# EAGLE design QUADBED (EAGLE 9.4.2)
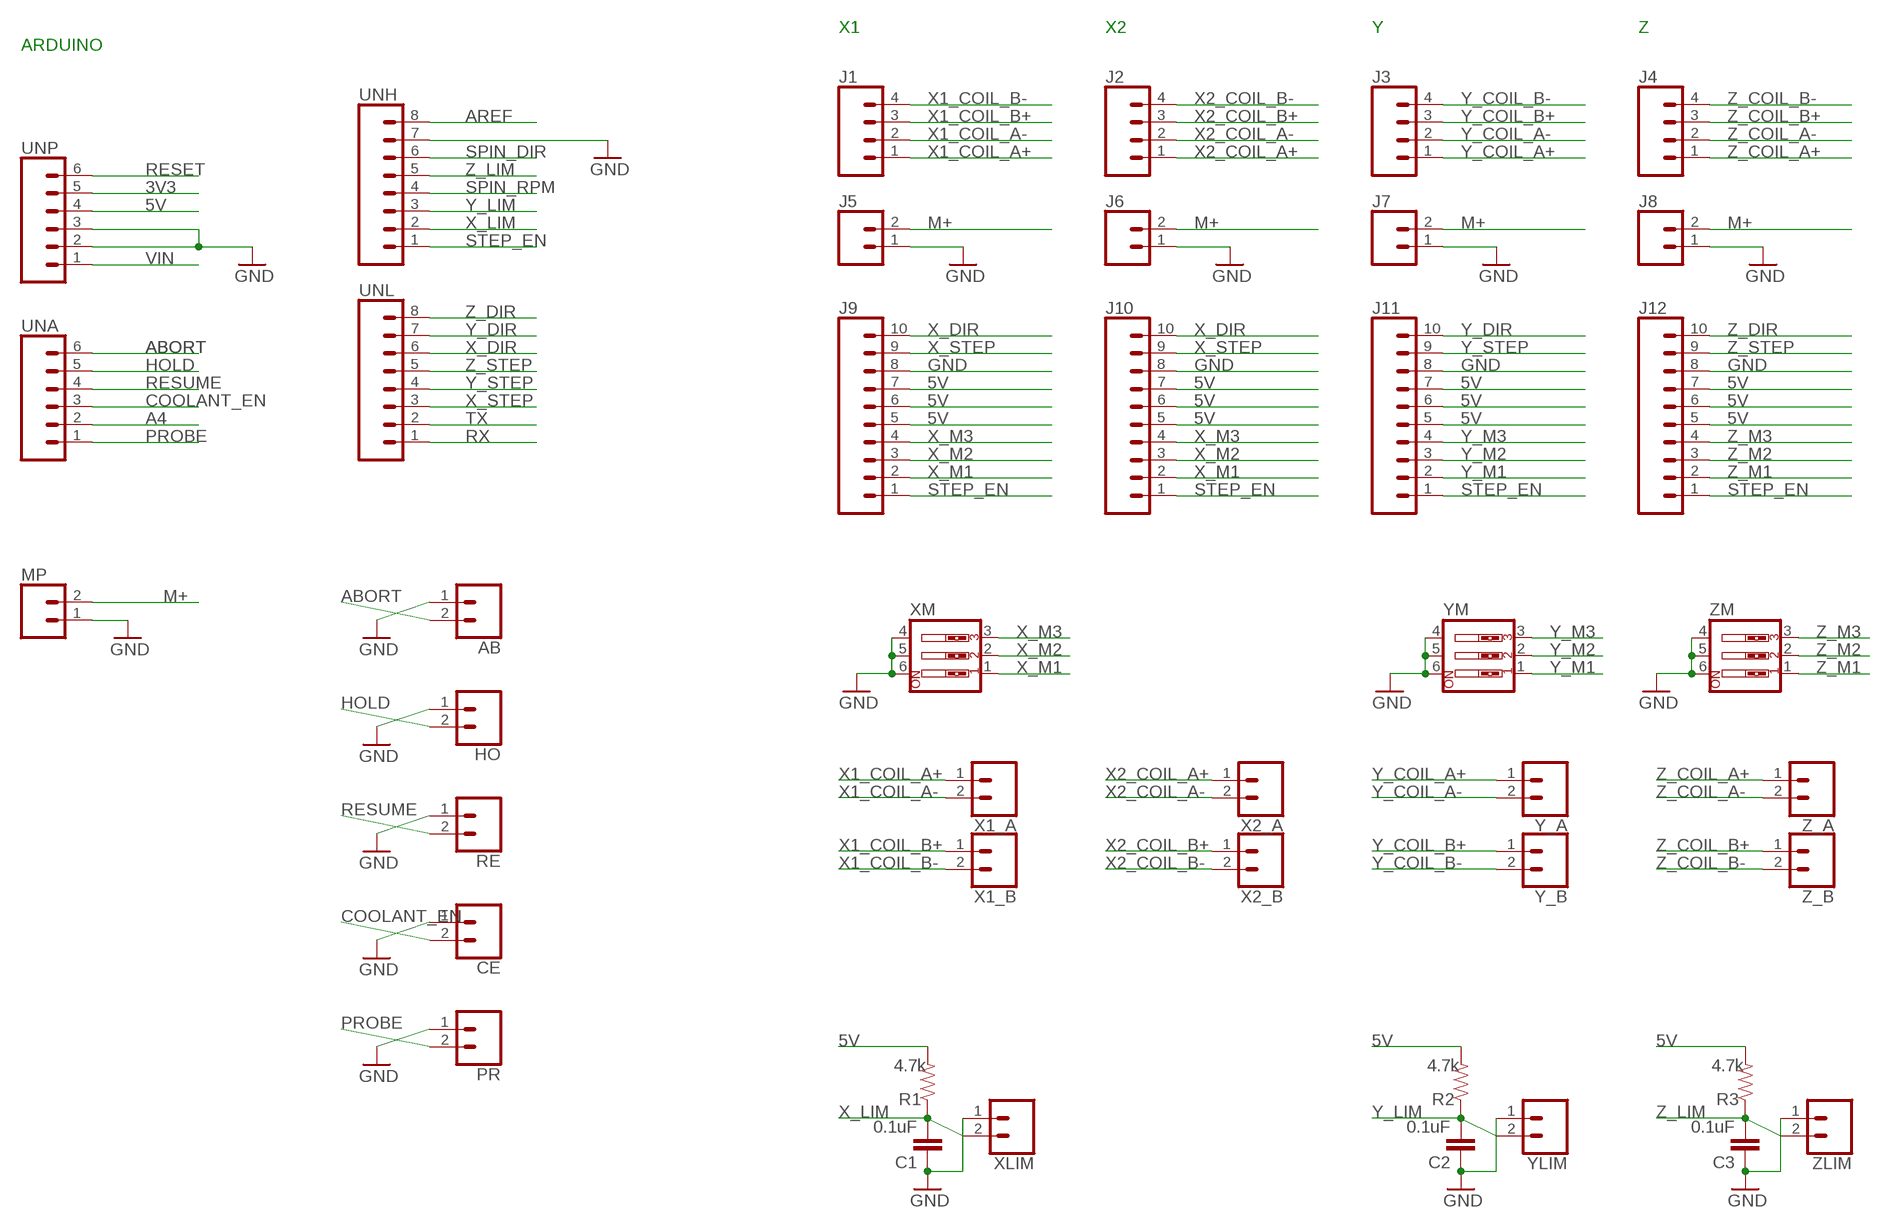
[diagram p0: schematic, sheet 1]

## Parts
AB  CONN_023.5MM  [SCREWTERMINAL-3.5MM-2]
C1  0.1uF  0.1UF-0603-100V-10%  [0603]
C2  0.1uF  0.1UF-0603-100V-10%  [0603]
C3  0.1uF  0.1UF-0603-100V-10%  [0603]
CE  CONN_023.5MM  [SCREWTERMINAL-3.5MM-2]
HO  CONN_023.5MM  [SCREWTERMINAL-3.5MM-2]
J1  CONN_04  [1X04]
J2  CONN_04  [1X04]
J3  CONN_04  [1X04]
J4  CONN_04  [1X04]
J5  CONN_02  [1X02]
J6  CONN_02  [1X02]
J7  CONN_02  [1X02]
J8  CONN_02  [1X02]
J9  CONN_10"  [1X10]
J10  CONN_10"  [1X10]
J11  CONN_10"  [1X10]
J12  CONN_10"  [1X10]
MP  CONN_023.5MM  [SCREWTERMINAL-3.5MM-2]
PR  CONN_023.5MM  [SCREWTERMINAL-3.5MM-2]
R1  4.7k  4.7KOHM-0603-1/10W-1%  [0603]
R2  4.7k  4.7KOHM-0603-1/10W-1%  [0603]
R3  4.7k  4.7KOHM-0603-1/10W-1%  [0603]
RE  CONN_023.5MM  [SCREWTERMINAL-3.5MM-2]
UNA  CONN_06SILK_FEMALE_PTH  [1X06]
UNH  CONN_08"  [1X08]
UNL  CONN_08"  [1X08]
UNP  CONN_06SILK_FEMALE_PTH  [1X06]
X1_A  CONN_023.5MM  [SCREWTERMINAL-3.5MM-2]
X1_B  CONN_023.5MM  [SCREWTERMINAL-3.5MM-2]
X2_A  CONN_023.5MM  [SCREWTERMINAL-3.5MM-2]
X2_B  CONN_023.5MM  [SCREWTERMINAL-3.5MM-2]
XLIM  CONN_023.5MM  [SCREWTERMINAL-3.5MM-2]
XM  SW_DIP-3  [EDG-03]
Y_A  CONN_023.5MM  [SCREWTERMINAL-3.5MM-2]
Y_B  CONN_023.5MM  [SCREWTERMINAL-3.5MM-2]
YLIM  CONN_023.5MM  [SCREWTERMINAL-3.5MM-2]
YM  SW_DIP-3  [EDG-03]
Z_A  CONN_023.5MM  [SCREWTERMINAL-3.5MM-2]
Z_B  CONN_023.5MM  [SCREWTERMINAL-3.5MM-2]
ZLIM  CONN_023.5MM  [SCREWTERMINAL-3.5MM-2]
ZM  SW_DIP-3  [EDG-03]

## Nets
3V3: UNP.5
5V: J9.5 J9.6 J9.7 J10.5 J10.6 J10.7 J11.5 J11.6 J11.7 J12.5 J12.6 J12.7 R1.2 R2.2 R3.2 UNP.4
A4: UNA.2
ABORT: AB.2 UNA.6
AREF: UNH.8
COOLANT_EN: CE.2 UNA.3
GND: AB.1 C1.1 C2.1 C3.1 CE.1 HO.1 J5.1 J6.1 J7.1 J8.1 J9.8 J10.8 J11.8 J12.8 MP.1 PR.1 RE.1 UNH.7 UNP.2 UNP.3 XLIM.1 XM.4 XM.5 XM.6 YLIM.1 YM.4 YM.5 YM.6 ZLIM.1 ZM.4 ZM.5 ZM.6
HOLD: HO.2 UNA.5
M+: J5.2 J6.2 J7.2 J8.2 MP.2
PROBE: PR.2 UNA.1
RESET: UNP.6
RESUME: RE.2 UNA.4
RX: UNL.1
SPIN_DIR: UNH.6
SPIN_RPM: UNH.4
STEP_EN: J9.1 J10.1 J11.1 J12.1 UNH.1
TX: UNL.2
VIN: UNP.1
X1_COIL_A+: J1.1 X1_A.1
X1_COIL_A-: J1.2 X1_A.2
X1_COIL_B+: J1.3 X1_B.1
X1_COIL_B-: J1.4 X1_B.2
X2_COIL_A+: J2.1 X2_A.1
X2_COIL_A-: J2.2 X2_A.2
X2_COIL_B+: J2.3 X2_B.1
X2_COIL_B-: J2.4 X2_B.2
X_DIR: J9.10 J10.10 UNL.6
X_LIM: C1.2 R1.1 UNH.2 XLIM.2
X_M1: J9.2 J10.2 XM.1
X_M2: J9.3 J10.3 XM.2
X_M3: J9.4 J10.4 XM.3
X_STEP: J9.9 J10.9 UNL.3
Y_COIL_A+: J3.1 Y_A.1
Y_COIL_A-: J3.2 Y_A.2
Y_COIL_B+: J3.3 Y_B.1
Y_COIL_B-: J3.4 Y_B.2
Y_DIR: J11.10 UNL.7
Y_LIM: C2.2 R2.1 UNH.3 YLIM.2
Y_M1: J11.2 YM.1
Y_M2: J11.3 YM.2
Y_M3: J11.4 YM.3
Y_STEP: J11.9 UNL.4
Z_COIL_A+: J4.1 Z_A.1
Z_COIL_A-: J4.2 Z_A.2
Z_COIL_B+: J4.3 Z_B.1
Z_COIL_B-: J4.4 Z_B.2
Z_DIR: J12.10 UNL.8
Z_LIM: C3.2 R3.1 UNH.5 ZLIM.2
Z_M1: J12.2 ZM.1
Z_M2: J12.3 ZM.2
Z_M3: J12.4 ZM.3
Z_STEP: J12.9 UNL.5

## Notes on the sheet
- X1 | X2 | Y | Z
- ARDUINO

## Library data of the parts
AB CE HO PR RE X1_A X1_B X2_A X2_B XLIM Y_A Y_B YLIM Z_A Z_B ZLIM = SparkFun-Connectors:CONN_02: Multi connection point. Often used as Generic Header-pin footprint for 0.1 inch spaced/style header connections On any of the 0.1 inch spaced packages, you can populate with these: Break Away Headers - Straight <https://www.sparkfun.com/products/116> (PRT-00116) Break Away Male Headers - Right Angle <https://www.sparkfun.com/products/553> (PRT-00553) Female Headers <https://www.sparkfun.com/products/115> (PRT-00115) Break Away Headers - Machine Pin <https://www.sparkfun.com/products/117> (PRT-00117) Break Away Female Headers - Swiss Machine Pin <https://www.sparkfun.com/products/743> (PRT-00743) For SCREWTERMINALS and SPRING TERMINALS visit here: Screw Terimnals on SparkFun.com <https://www.sparkfun.com/search/results?term=Screw+Terminals> (5mm/3.5mm/2.54mm spacing) This device is also useful as a general connection point to wire up your design to another part of your project. Our various solder wires solder well into these plated through hole pads. Hook-Up Wire - Assortment (Stranded, 22 AWG) <https://www.sparkfun.com/products/11375> (PRT-11375) Hook-Up Wire - Assortment (Solid Core, 22 AWG) <https://www.sparkfun.com/products/11367> (PRT-11367) View the entire wire category on our website here <https://www.sparkfun.com/categories/141> Special notes: Molex polarized connector foot print use with: PRT-08233 with associated crimp pins and housings. 2.54_SCREWTERM for use with PRT-10571. 3.5mm Screw Terminal footprints for PRT-08084 5mm Screw Terminal footprints for use with PRT-08432; PROD_ID: CONN-08399
C1-C3 = SparkFun-Capacitors:0.1UF: 0.1µF ceramic capacitors A capacitor is a passive two-terminal electrical component used to store electrical energy temporarily in an electric field.; PROD_ID: CAP-08390
J1-J4 = SparkFun-Connectors:CONN_04: Multi connection point. Often used as Generic Header-pin footprint for 0.1 inch spaced/style header connections On any of the 0.1 inch spaced packages, you can populate with these: Break Away Headers - Straight <https://www.sparkfun.com/products/116> (PRT-00116) Break Away Male Headers - Right Angle <https://www.sparkfun.com/products/553> (PRT-00553) Female Headers <https://www.sparkfun.com/products/115> (PRT-00115) Break Away Headers - Machine Pin <https://www.sparkfun.com/products/117> (PRT-00117) Break Away Female Headers - Swiss Machine Pin <https://www.sparkfun.com/products/743> (PRT-00743) For SCREWTERMINALS and SPRING TERMINALS visit here: Screw Terimnals on SparkFun.com <https://www.sparkfun.com/search/results?term=Screw+Terminals> (5mm/3.5mm/2.54mm spacing) This device is also useful as a general connection point to wire up your design to another part of your project. Our various solder wires solder well into these plated through hole pads. Hook-Up Wire - Assortment (Stranded, 22 AWG) <https://www.sparkfun.com/products/11375> (PRT-11375) Hook-Up Wire - Assortment (Solid Core, 22 AWG) <https://www.sparkfun.com/products/11367> (PRT-11367) View the entire wire category on our website here <https://www.sparkfun.com/categories/141> Special notes: Molex polarized connector foot print use with SKU : PRT-08231 with associated crimp pins and housings. 1MM SMD Version SKU: PRT-10208; PROD_ID: CONN-09696
J5-J8 = SparkFun-Connectors:CONN_02: Multi connection point. Often used as Generic Header-pin footprint for 0.1 inch spaced/style header connections On any of the 0.1 inch spaced packages, you can populate with these: Break Away Headers - Straight <https://www.sparkfun.com/products/116> (PRT-00116) Break Away Male Headers - Right Angle <https://www.sparkfun.com/products/553> (PRT-00553) Female Headers <https://www.sparkfun.com/products/115> (PRT-00115) Break Away Headers - Machine Pin <https://www.sparkfun.com/products/117> (PRT-00117) Break Away Female Headers - Swiss Machine Pin <https://www.sparkfun.com/products/743> (PRT-00743) For SCREWTERMINALS and SPRING TERMINALS visit here: Screw Terimnals on SparkFun.com <https://www.sparkfun.com/search/results?term=Screw+Terminals> (5mm/3.5mm/2.54mm spacing) This device is also useful as a general connection point to wire up your design to another part of your project. Our various solder wires solder well into these plated through hole pads. Hook-Up Wire - Assortment (Stranded, 22 AWG) <https://www.sparkfun.com/products/11375> (PRT-11375) Hook-Up Wire - Assortment (Solid Core, 22 AWG) <https://www.sparkfun.com/products/11367> (PRT-11367) View the entire wire category on our website here <https://www.sparkfun.com/categories/141> Special notes: Molex polarized connector foot print use with: PRT-08233 with associated crimp pins and housings. 2.54_SCREWTERM for use with PRT-10571. 3.5mm Screw Terminal footprints for PRT-08084 5mm Screw Terminal footprints for use with PRT-08432
J9-J12 = SparkFun-Connectors:CONN_10: Multi connection point. Often used as Generic Header-pin footprint for 0.1 inch spaced/style header connections On any of the 0.1 inch spaced packages, you can populate with these: Break Away Headers - Straight <https://www.sparkfun.com/products/116> (PRT-00116) Break Away Male Headers - Right Angle <https://www.sparkfun.com/products/553> (PRT-00553) Female Headers <https://www.sparkfun.com/products/115> (PRT-00115) Break Away Headers - Machine Pin <https://www.sparkfun.com/products/117> (PRT-00117) Break Away Female Headers - Swiss Machine Pin <https://www.sparkfun.com/products/743> (PRT-00743) Arduino Stackable Header - 10 Pin <https://www.sparkfun.com/products/11376> (PRT-11376) For SCREWTERMINALS and SPRING TERMINALS visit here: Screw Terimnals on SparkFun.com <https://www.sparkfun.com/search/results?term=Screw+Terminals> (5mm/3.5mm/2.54mm spacing) This device is also useful as a general connection point to wire up your design to another part of your project. Our various solder wires solder well into these plated through hole pads. Hook-Up Wire - Assortment (Stranded, 22 AWG) <https://www.sparkfun.com/products/11375> (PRT-11375) Hook-Up Wire - Assortment (Solid Core, 22 AWG) <https://www.sparkfun.com/products/11367> (PRT-11367) View the entire wire category on our website here <https://www.sparkfun.com/categories/141> Special notes: Molex polarized connector foot print use with SKU : PRT-08231 with associated crimp pins and housings. 1MM SMD Version SKU: PRT-10208 NOTES ON THE VARIANTS LOCK and LOCK_LONGPADS... This footprint was designed to help hold the alignment of a through-hole component (i.e. 6-pin header) while soldering it into place. You may notice that each hole has been shifted either up or down by 0.005 of an inch from it's more standard position (which is a perfectly straight line). This slight alteration caused the pins (the squares in the middle) to touch the edges of the holes. Because they are alternating, it causes a "brace" to hold the component in place. 0.005 has proven to be the perfect amount of "off-center" position when using our standard breakaway headers. Although looks a little odd when you look at the bare footprint, once you have a header in there, the alteration is very hard to notice. Also,if you push a header all the way into place, it is covered up entirely on the bottom side.; PROD_ID: CONN-11563
MP = SparkFun-Connectors:CONN_02: Multi connection point. Often used as Generic Header-pin footprint for 0.1 inch spaced/style header connections On any of the 0.1 inch spaced packages, you can populate with these: Break Away Headers - Straight <https://www.sparkfun.com/products/116> (PRT-00116) Break Away Male Headers - Right Angle <https://www.sparkfun.com/products/553> (PRT-00553) Female Headers <https://www.sparkfun.com/products/115> (PRT-00115) Break Away Headers - Machine Pin <https://www.sparkfun.com/products/117> (PRT-00117) Break Away Female Headers - Swiss Machine Pin <https://www.sparkfun.com/products/743> (PRT-00743) For SCREWTERMINALS and SPRING TERMINALS visit here: Screw Terimnals on SparkFun.com <https://www.sparkfun.com/search/results?term=Screw+Terminals> (5mm/3.5mm/2.54mm spacing) This device is also useful as a general connection point to wire up your design to another part of your project. Our various solder wires solder well into these plated through hole pads. Hook-Up Wire - Assortment (Stranded, 22 AWG) <https://www.sparkfun.com/products/11375> (PRT-11375) Hook-Up Wire - Assortment (Solid Core, 22 AWG) <https://www.sparkfun.com/products/11367> (PRT-11367) View the entire wire category on our website here <https://www.sparkfun.com/categories/141> Special notes: Molex polarized connector foot print use with: PRT-08233 with associated crimp pins and housings. 2.54_SCREWTERM for use with PRT-10571. 3.5mm Screw Terminal footprints for PRT-08084 5mm Screw Terminal footprints for use with PRT-08432; PROD_ID: CONN-08399; SPICEPREFIX: B
R1-R3 = SparkFun-Resistors:4.7KOHM: 4.7kΩ resistor A resistor is a passive two-terminal electrical component that implements electrical resistance as a circuit element. Resistors act to reduce current flow, and, at the same time, act to lower voltage levels within circuits. - Wikipedia; PROD_ID: RES-07857
UNA UNP = SparkFun-Connectors:CONN_06: Multi connection point. Often used as Generic Header-pin footprint for 0.1 inch spaced/style header connections On any of the 0.1 inch spaced packages, you can populate with these: Break Away Headers - Straight <https://www.sparkfun.com/products/116> (PRT-00116) Break Away Male Headers - Right Angle <https://www.sparkfun.com/products/553> (PRT-00553) Female Headers <https://www.sparkfun.com/products/115> (PRT-00115) Break Away Headers - Machine Pin <https://www.sparkfun.com/products/117> (PRT-00117) Break Away Female Headers - Swiss Machine Pin <https://www.sparkfun.com/products/743> (PRT-00743) Arduino Stackable Header - 6 Pin <https://www.sparkfun.com/products/9280> (PRT-09280) For SCREWTERMINALS and SPRING TERMINALS visit here: Screw Terimnals on SparkFun.com <https://www.sparkfun.com/search/results?term=Screw+Terminals> (5mm/3.5mm/2.54mm spacing) This device is also useful as a general connection point to wire up your design to another part of your project. Our various solder wires solder well into these plated through hole pads. Hook-Up Wire - Assortment (Stranded, 22 AWG) <https://www.sparkfun.com/products/11375> (PRT-11375) Hook-Up Wire - Assortment (Solid Core, 22 AWG) <https://www.sparkfun.com/products/11367> (PRT-11367) View the entire wire category on our website here <https://www.sparkfun.com/categories/141>; PROD_ID: CONN-08437
UNH UNL = SparkFun-Connectors:CONN_08: Multi connection point. Often used as Generic Header-pin footprint for 0.1 inch spaced/style header connections On any of the 0.1 inch spaced packages, you can populate with these: Break Away Headers - Straight <https://www.sparkfun.com/products/116> (PRT-00116) Break Away Male Headers - Right Angle <https://www.sparkfun.com/products/553> (PRT-00553) Female Headers <https://www.sparkfun.com/products/115> (PRT-00115) Break Away Headers - Machine Pin <https://www.sparkfun.com/products/117> (PRT-00117) Break Away Female Headers - Swiss Machine Pin <https://www.sparkfun.com/products/743> (PRT-00743) Arduino Stackable Header - 8 Pin <https://www.sparkfun.com/products/9279> (PRT-09279) For SCREWTERMINALS and SPRING TERMINALS visit here: Screw Terimnals on SparkFun.com <https://www.sparkfun.com/search/results?term=Screw+Terminals> (5mm/3.5mm/2.54mm spacing) This device is also useful as a general connection point to wire up your design to another part of your project. Our various solder wires solder well into these plated through hole pads. Hook-Up Wire - Assortment (Stranded, 22 AWG) <https://www.sparkfun.com/products/11375> (PRT-11375) Hook-Up Wire - Assortment (Solid Core, 22 AWG) <https://www.sparkfun.com/products/11367> (PRT-11367) View the entire wire category on our website here <https://www.sparkfun.com/categories/141> Special notes: Molex polarized connector foot print use with SKU : PRT-08231 with associated crimp pins and housings. 1MM SMD Version SKU: PRT-10208 NOTES ON THE VARIANTS LOCK and LOCK_LONGPADS... This footprint was designed to help hold the alignment of a through-hole component (i.e. 6-pin header) while soldering it into place. You may notice that each hole has been shifted either up or down by 0.005 of an inch from it's more standard position (which is a perfectly straight line). This slight alteration caused the pins (the squares in the middle) to touch the edges of the holes. Because they are alternating, it causes a "brace" to hold the component in place. 0.005 has proven to be the perfect amount of "off-center" position when using our standard breakaway headers. Although looks a little odd when you look at the bare footprint, once you have a header in there, the alteration is very hard to notice. Also,if you push a header all the way into place, it is covered up entirely on the bottom side.; PROD_ID: CONN-08438
XM YM ZM = special:SW_DIP-3: DIP SWITCH

## Board
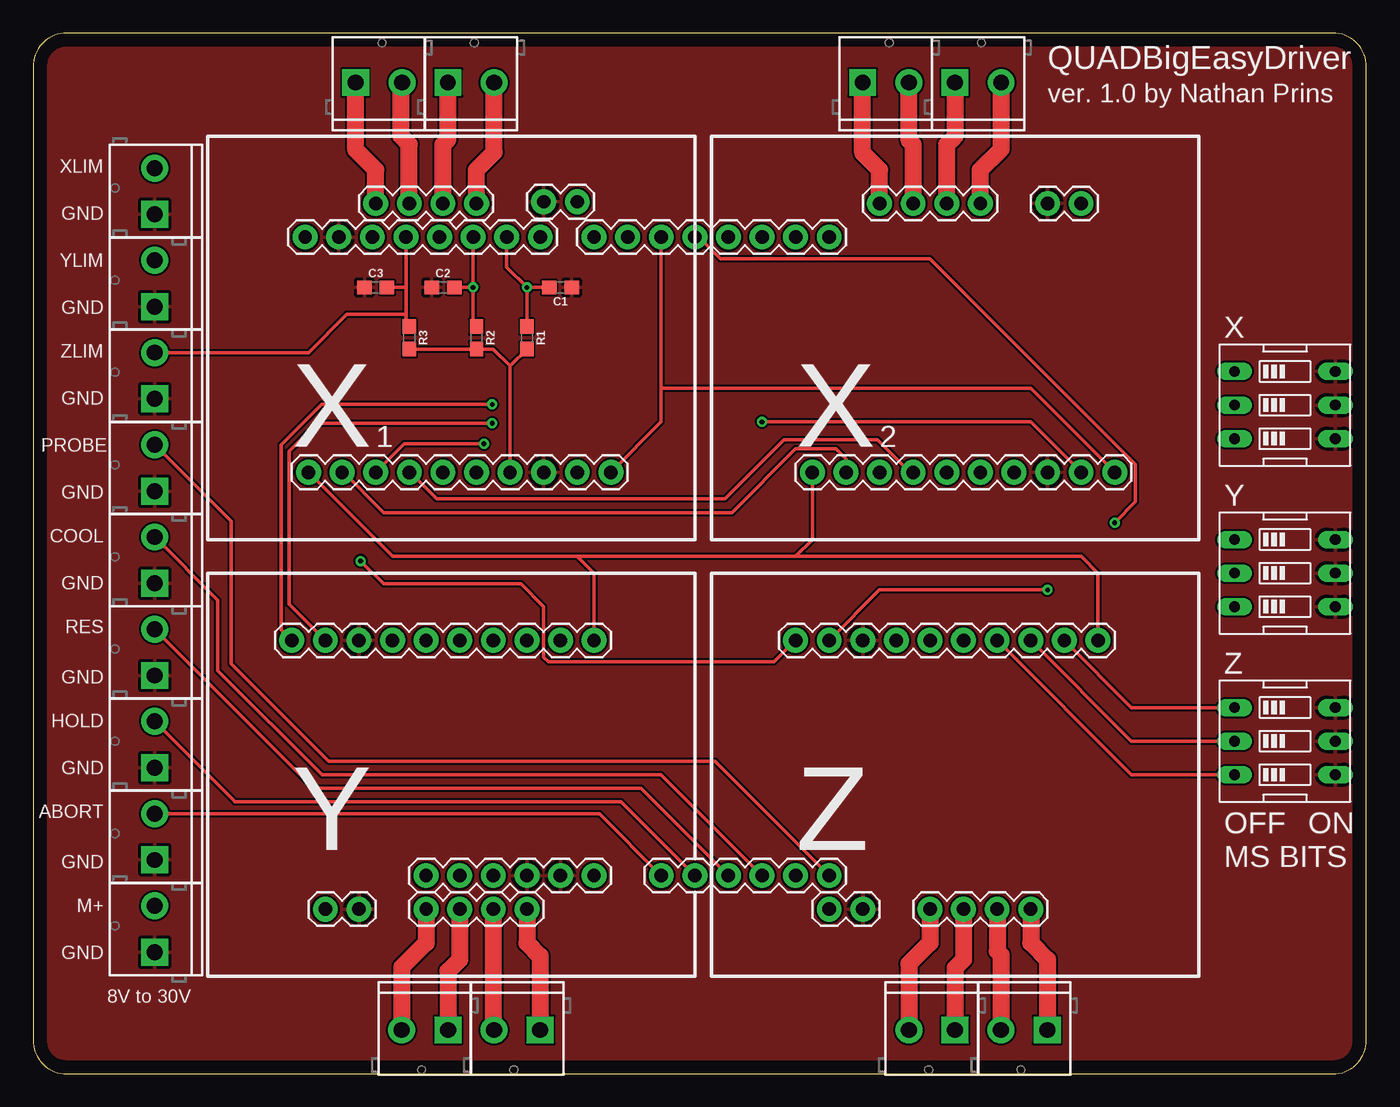
[diagram p1: board, top side]
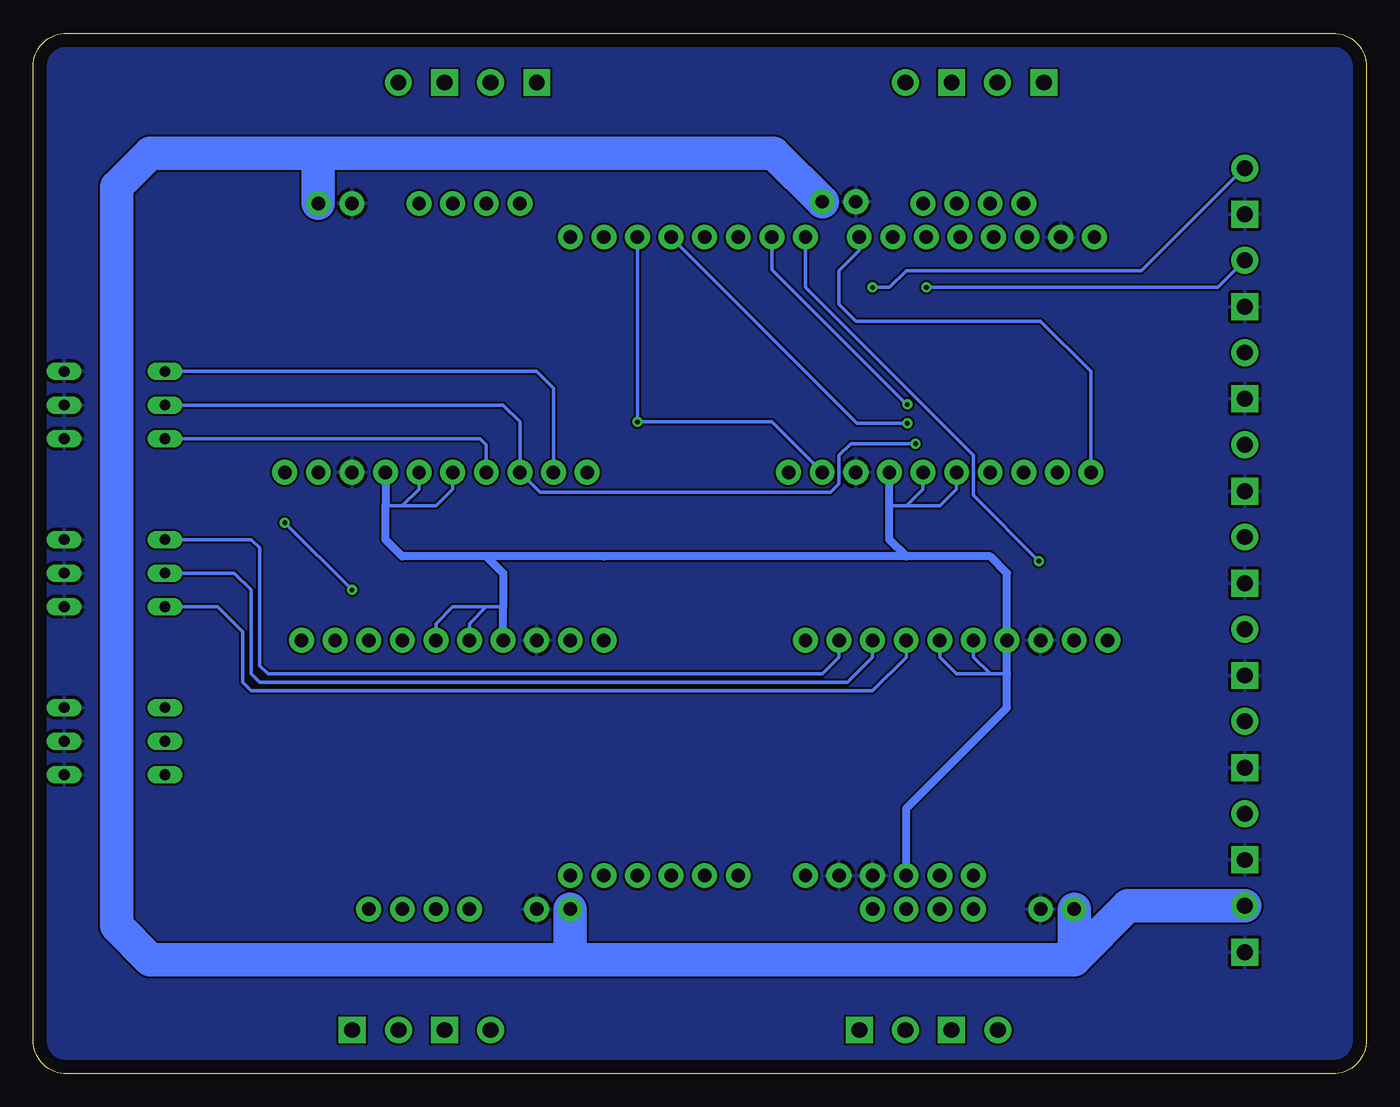
[diagram p2: board, bottom side, seen from below]

Size 100.82 x 78.66 mm. Coordinates in mm from the lower left corner, seen from the top.
Outline: 0,76.12 0,2.54 arc90 2.54,0 98.28,0 arc90 100.82,2.54 100.82,76.12 arc90 98.28,78.66 2.54,78.66 arc90 0,76.12
Copper layers (1*16): Top 0.035mm / dielectric 1.5mm / Bottom 0.035mm
Design rules "default": minimum track width 6mil, minimum drill 0.35mm, track to track 6mil, track to pad 6mil, pad to pad 6mil, via to via 6mil, smd to smd 6mil, copper to edge 40mil, drill to drill 6mil, minimum pad ring 10mil, minimum via ring 8mil, stop-mask expansion 4mil, vias tented up to drill 0mil, thermal gap 10mil

### Footprints (pad centres in the part's own frame; a part is rotated, then mirrored left to right if it is on the bottom)
SCREWTERMINAL-3.5MM-2 = drill 1.2 pad 2.032 square: 1 0,0 | drill 1.2 pad 2.032: 2 3.5,0
0603 = smd 1.1 x 1: 1 -0.85,0; 2 0.85,0
1X04 = drill 1.016 pad 1.88: 1 0,0; 2 2.54,0; 3 5.08,0; 4 7.62,0
1X02 = drill 1.016 pad 1.88: 1 0,0; 2 2.54,0
1X10 = drill 1.016 pad 1.88: 1 0,0; 2 2.54,0; 3 5.08,0; 4 7.62,0; 5 10.16,0; 6 12.7,0; 7 15.24,0; 8 17.78,0; 9 20.32,0; 10 22.86,0
1X06 = drill 1.016 pad 1.88: 1 0,0; 2 2.54,0; 3 5.08,0; 4 7.62,0; 5 10.16,0; 6 12.7,0
1X08 = drill 1.016 pad 1.88: 1 0,0; 2 2.54,0; 3 5.08,0; 4 7.62,0; 5 10.16,0; 6 12.7,0; 7 15.24,0; 8 17.78,0
EDG-03 = drill 0.813 long: 1 -2.54,-3.81; 2 0,-3.81; 3 2.54,-3.81; 4 2.54,3.81; 5 0,3.81; 6 -2.54,3.81

### Placement (x,y rotation side)
AB  9.2,16.17 90 top
C1  39.88,59.44 180 top
C2  30.99,59.44 0 top
C3  25.91,59.44 0 top
CE  9.2,37.08 90 top
HO  9.2,23.14 90 top
J1  25.91,65.79 0 top
J2  64.01,65.79 0 top
J3  37.34,12.45 180 top
J4  75.44,12.45 180 top
J5  38.61,65.91 0 top
J6  76.71,65.79 0 top
J7  24.64,12.45 180 top
J8  62.74,12.45 180 top
J9  20.83,45.47 0 top
J10  58.93,45.47 0 top
J11  42.42,32.77 180 top
J12  80.52,32.77 180 top
MP  9.2,9.2 90 top
PR  9.2,44.05 90 top
R1  37.34,55.63 270 top
R2  33.53,55.63 270 top
R3  28.45,55.63 270 top
RE  9.2,30.11 90 top
UNA  60.2,14.99 180 top
UNH  38.35,63.25 180 top
UNL  60.2,63.25 180 top
UNP  42.42,14.99 180 top
X1_A  24.39,74.93 0 top
X1_B  31.36,74.93 0 top
X2_A  62.73,74.93 0 top
X2_B  69.7,74.93 0 top
XLIM  9.2,64.96 90 top
XM  94.66,50.55 270 top
Y_A  38.35,3.31 180 top
Y_B  31.38,3.31 180 top
YLIM  9.2,57.99 90 top
YM  94.66,37.85 270 top
Z_A  76.68,3.31 180 top
Z_B  69.71,3.31 180 top
ZLIM  9.2,51.02 90 top
ZM  94.66,25.15 270 top

### Tracks (layer width: path | path; a pad name or v marks a point on that pad's centre or on a via)
5V
  Top 0.254: R3.2 R2.2 34.8,54.78 36.07,53.51 | J9.7 36.07,53.51 | R1.2 36.07,53.51
  Bottom 0.254: J10.6 71.63,44.2 72.9,42.93 | 74.17,42.93 72.9,42.93 | 72.9,42.93 70.36,42.93 69.09,44.2 J10.5 | 36.07,42.93 34.8,42.93 | 34.8,42.93 33.53,44.2 J9.6 | 34.8,42.93 32.26,42.93 30.99,44.2 J9.5 | J11.6 29.72,31.5 28.45,30.23 | 27.18,30.23 28.45,30.23 | 28.45,30.23 30.99,30.23 32.26,31.5 J11.5 | 65.28,35.31 66.55,35.31 | 66.55,35.31 69.09,35.31 70.36,34.04 J12.5 | J12.6 67.82,34.04 66.55,35.31
  Bottom 0.61: UNP.4 34.8,20.07 27.18,27.69 27.18,30.23 J11.7 27.18,37.85 28.45,39.12 34.8,39.12 | J12.7 65.28,35.31 65.28,37.85 66.55,39.12 | 66.55,39.12 72.9,39.12 74.17,40.39 74.17,42.93 J10.7 | 34.8,39.12 36.07,40.39 36.07,42.93 J9.7 | 34.8,39.12 57.66,39.12 66.55,39.12
ABORT
  Top 0.254: AB.2 42.82,19.67 UNA.6
COOLANT_EN
  Top 0.254: CE.2 13.97,35.8 13.97,30.48 21.84,22.61 47.5,22.61 UNA.3
GND
  pour Bottom: 0,-0.25 100.84,-0.25 100.84,78.49 0,78.49
  pour Top: 0,-0.25 100.84,-0.25 100.84,78.49 0,78.49
HOLD
  Top 0.254: HO.2 15.24,20.59 15.24,20.57 44.45,20.57 UNA.5
M+
  Bottom 2.54: 22.1,8.64 J7.2 | J8.2 60.2,8.64 | 22.1,8.64 60.2,8.64 | 60.2,8.64 91.95,8.64 94.49,11.18 94.49,67.06 91.95,69.6 79.25,69.6 | 79.25,69.6 J6.2 | 79.25,69.6 44.83,69.6 J5.2 | MP.2 18.04,12.7 22.1,8.64
PROBE
  Top 0.254: PR.2 14.99,41.76 14.99,30.99 22.35,23.62 51.56,23.62 UNA.1
RESUME
  Top 0.254: RE.2 21.21,21.59 45.97,21.59 UNA.4
STEP_EN
  Top 0.254: J9.1 27.18,39.12 41.15,39.12 | J11.1 42.42,37.85 41.15,39.12 | 41.15,39.12 57.66,39.12 | 57.66,39.12 58.93,40.39 J10.1 | 57.66,39.12 79.25,39.12 80.52,37.85 J12.1
  Bottom 0.254: UNH.1 38.35,62.23 39.88,60.71 39.88,58.17 38.61,56.9 24.64,56.9 20.83,53.09 J9.1
X1_COIL_A+
  Top 1.27: J1.1 25.91,68.33 24.39,69.84 X1_A.1
X1_COIL_A-
  Top 1.27: J1.2 28.45,70.23 27.81,70.87 27.81,74.85 X1_A.2
X1_COIL_B+
  Top 1.27: J1.3 30.99,70.23 31.36,70.61 X1_B.1
X1_COIL_B-
  Top 1.27: J1.4 33.53,68.33 34.86,69.66 X1_B.2
X2_COIL_A+
  Top 1.27: J2.1 64.01,68.33 62.73,69.61 X2_A.1
X2_COIL_A-
  Top 1.27: J2.2 66.55,70.23 66.23,70.55 X2_A.2
X2_COIL_B+
  Top 1.27: J2.3 69.09,70.23 69.72,70.87 69.72,74.91 X2_B.1
X2_COIL_B-
  Top 1.27: J2.4 71.63,68.33 73.2,69.9 X2_B.2
X_DIR
  Top 0.254: UNL.6 47.5,51.82 | J9.10 47.5,49.28 47.5,51.82 | 47.5,51.82 75.44,51.82 J10.10
X_LIM  (via drill 0.35)
  Top 0.254: UNH.2 35.81,60.96 v37.34,59.44 | C1.2 v37.34,59.44 | R1.1 v37.34,59.44
  Bottom 0.254: v37.34,59.44 36.07,59.44 34.8,60.71 17.02,60.71 9.27,68.46 XLIM.2
X_M1
  Top 0.254: J9.2 23.47,45.47 26.52,42.42 52.83,42.42 57.66,47.24 60.71,47.24 61.47,46.48 J10.2
  Bottom 0.254: XM.1 62.74,53.09 61.47,51.82 J10.2
X_M2  (via drill 0.35)
  Top 0.254: v34.09,47.62 28.07,47.62 J9.3
  Bottom 0.254: XM.2 65.28,50.55 64.01,49.28 J10.3 62.48,43.94 40.54,43.94 39.88,44.6 39.88,46.74 38.99,47.62 v34.09,47.62
X_M3
  Top 0.254: J10.4 66.29,45.47 63.83,47.93 56.79,47.93 55.36,46.49 52.32,43.46 30.51,43.46 28.5,45.47 J9.4
  Bottom 0.254: XM.3 67.02,48.01 66.55,47.53 J10.4
X_STEP  (via drill 0.35)
  Top 0.254: v55.12,49.28 75.44,49.28 J10.9
  Bottom 0.254: UNL.3 v55.12,49.28 44.96,49.28 J9.9
Y_COIL_A+
  Top 1.27: J3.1 37.34,9.91 38.35,8.9 Y_A.1
Y_COIL_A-
  Top 1.27: J3.2 34.8,3.36 Y_A.2
Y_COIL_B+
  Top 1.27: J3.3 32.26,8.64 31.38,7.76 Y_B.1
Y_COIL_B-
  Top 1.27: J3.4 29.72,9.91 27.88,8.07 Y_B.2
Y_DIR  (via drill 0.35)
  Top 0.254: v34.72,50.6 21.82,50.6 18.76,47.54 18.76,33.57 J11.10
  Bottom 0.152: 34.8,50.6 v34.72,50.6
  Bottom 0.254: UNL.7 44.96,60.76 34.8,50.6
Y_LIM  (via drill 0.35)
  Top 0.254: C2.2 v33.27,59.44 | UNH.3 v33.27,59.44 | R2.1 33.27,56.73 v33.27,59.44
  Bottom 0.254: v33.27,59.44 11.25,59.44 YLIM.2
Y_M1
  Bottom 0.254: YM.1 84.33,40.39 83.69,39.75 83.69,30.86 83.06,30.23 41.15,30.23 39.88,31.5 J11.2
Y_M2
  Bottom 0.254: YM.2 85.6,37.85 84.33,36.58 84.33,30.23 83.69,29.59 39.24,29.59 37.34,31.5 J11.3
Y_M3
  Bottom 0.254: YM.3 86.87,35.31 84.96,33.4 84.96,29.59 84.33,28.96 37.34,28.96 34.8,31.5 J11.4
Y_STEP  (via drill 0.35)
  Top 0.254: v34.72,49.17 21.49,49.17 19.36,47.04 19.36,35.51 J11.9
  Bottom 0.152: 34.8,49.17 v34.72,49.17
  Bottom 0.254: UNL.4 38.51,49.17 34.8,49.17
Z_COIL_A+
  Top 1.27: J4.1 75.44,9.91 76.71,8.64 76.71,3.34 Z_A.1
Z_COIL_A-
  Top 1.27: J4.2 72.9,9.27 73.18,8.99 Z_A.2
Z_COIL_B+
  Top 1.27: J4.3 70.36,8.64 69.71,7.99 Z_B.1
Z_COIL_B-
  Top 1.27: J4.4 67.82,9.91 66.21,8.3 Z_B.2
Z_DIR  (via drill 0.35)
  Top 0.254: v24.77,38.76 26.49,37.03 34.8,37.03 35.26,37.03 36.88,37.03 38.61,35.31 38.61,31.5 38.96,31.14 55.93,31.14 56.03,31.14 J12.10
  Bottom 0.254: UNL.8 42.42,59.44 29.72,46.74 29.72,43.71 v24.77,38.76
Z_LIM
  Top 0.152: 27.18,59.44 C3.2
  Top 0.254: UNH.5 28.19,59.44 | 27.18,59.44 28.19,59.44 | R3.1 28.19,56.73 28.19,57.4 | 28.19,59.44 28.19,57.4 | 28.19,57.4 23.72,57.4 20.83,54.52 ZLIM.2
Z_M1
  Top 0.254: ZM.1 83.06,27.69 J12.2
Z_M2
  Top 0.254: ZM.2 83.06,25.15 J12.3
Z_M3
  Top 0.152: 90.68,22.61 ZM.3
  Top 0.254: J12.4 83.06,22.61 90.68,22.61
Z_STEP  (via drill 0.35)
  Top 0.254: UNL.5 50.34,63.25 51.97,61.62 67.82,61.62 83.36,46.08 83.36,43.23 v81.79,41.66 | v76.71,36.58 64.01,36.58 J12.9
  Bottom 0.254: v81.79,41.66 v76.71,36.58

### Text on the board
tPlace: QUADBigEasyDriver | ver. 1.0 by Nathan Prins | XLIM | GND | YLIM | GND | X | ZLIM | GND | PROBE | X | 1 | X | 2 | GND | Y | COOL | GND | RES | GND | Z | HOLD | GND | ABORT | OFF | ON | GND | Y | Z | MS BITS | M+ | GND | 8V to 30V